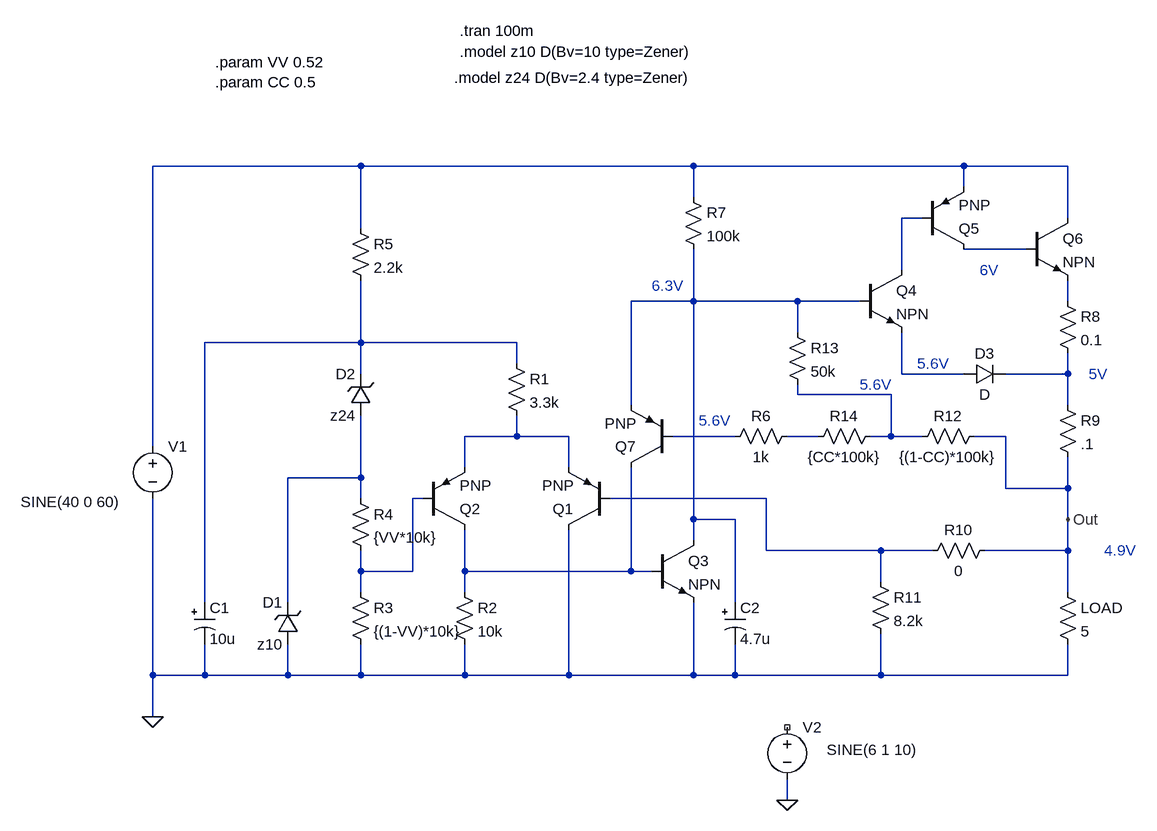
[diagram p0: schematic linear-power-supply.asc]
linear-power-supply.asc, the LTspice schematic file:
Version 4
SHEET 1 928 768
WIRE -272 -224 -592 -224
WIRE 240 -224 -272 -224
WIRE 656 -224 240 -224
WIRE 816 -224 656 -224
WIRE 656 -192 656 -224
WIRE 240 -176 240 -224
WIRE 592 -144 560 -144
WIRE 816 -144 816 -224
WIRE -272 -128 -272 -224
WIRE 752 -96 656 -96
WIRE 560 -64 560 -144
WIRE 240 -16 240 -96
WIRE 240 -16 144 -16
WIRE 400 -16 240 -16
WIRE 496 -16 400 -16
WIRE 816 -16 816 -48
WIRE 400 32 400 -16
WIRE -272 48 -272 -48
WIRE -272 48 -512 48
WIRE -32 48 -272 48
WIRE -32 80 -32 48
WIRE -272 96 -272 48
WIRE 560 96 560 32
WIRE 656 96 560 96
WIRE 816 96 816 64
WIRE 816 96 720 96
WIRE 400 128 400 112
WIRE 544 128 400 128
WIRE 144 144 144 -16
WIRE 816 144 816 96
WIRE -32 192 -32 160
WIRE -32 192 -112 192
WIRE 48 192 -32 192
WIRE 304 192 208 192
WIRE 432 192 384 192
WIRE 544 192 544 128
WIRE 544 192 512 192
WIRE 592 192 544 192
WIRE 720 192 672 192
WIRE -592 208 -592 -224
WIRE -112 240 -112 192
WIRE 48 240 48 192
WIRE -272 256 -272 160
WIRE -272 256 -384 256
WIRE 720 272 720 192
WIRE 816 272 816 224
WIRE 816 272 720 272
WIRE -272 288 -272 256
WIRE -176 288 -192 288
WIRE 352 288 112 288
WIRE 240 320 240 -16
WIRE 304 320 240 320
WIRE 816 320 816 272
WIRE 240 352 240 320
WIRE 352 368 352 288
WIRE 528 368 352 368
WIRE 608 368 528 368
WIRE 816 368 816 320
WIRE 816 368 688 368
WIRE -272 400 -272 368
WIRE -192 400 -192 288
WIRE -192 400 -272 400
WIRE -112 400 -112 336
WIRE 144 400 144 240
WIRE 144 400 -112 400
WIRE 176 400 144 400
WIRE 528 416 528 368
WIRE -272 432 -272 400
WIRE -112 432 -112 400
WIRE 816 432 816 368
WIRE -512 448 -512 48
WIRE -384 448 -384 256
WIRE 304 448 304 320
WIRE -592 560 -592 288
WIRE -512 560 -512 512
WIRE -512 560 -592 560
WIRE -384 560 -384 512
WIRE -384 560 -512 560
WIRE -272 560 -272 512
WIRE -272 560 -384 560
WIRE -112 560 -112 512
WIRE -112 560 -272 560
WIRE 48 560 48 336
WIRE 48 560 -112 560
WIRE 240 560 240 448
WIRE 240 560 48 560
WIRE 304 560 304 512
WIRE 304 560 240 560
WIRE 528 560 528 496
WIRE 528 560 304 560
WIRE 816 560 816 512
WIRE 816 560 528 560
WIRE -592 624 -592 560
WIRE 384 752 384 720
FLAG -592 624 0
FLAG 816 320 Out
FLAG 384 752 0
SYMBOL pnp 112 336 R180
SYMATTR InstName Q1
SYMBOL pnp -176 336 M180
SYMATTR InstName Q2
SYMBOL res -48 64 R0
SYMATTR InstName R1
SYMATTR Value 3.3k
SYMBOL res -128 416 R0
SYMATTR InstName R2
SYMATTR Value 10k
SYMBOL res -288 416 R0
SYMATTR InstName R3
SYMATTR Value {(1-VV)*10k}
SYMBOL res -288 272 R0
SYMATTR InstName R4
SYMATTR Value {VV*10k}
SYMBOL res -288 -144 R0
SYMATTR InstName R5
SYMATTR Value 2.2k
SYMBOL zener -368 512 R180
WINDOW 0 24 64 Left 2
WINDOW 3 24 0 Left 2
SYMATTR InstName D1
SYMATTR Value z10
SYMBOL zener -256 160 R180
WINDOW 0 24 64 Left 2
WINDOW 3 24 0 Left 2
SYMATTR InstName D2
SYMATTR Value z24
SYMBOL voltage -592 192 R0
WINDOW 3 -203 101 Left 2
SYMATTR Value SINE(40 0 60)
SYMATTR InstName V1
SYMBOL polcap -528 448 R0
SYMATTR InstName C1
SYMATTR Value 10u
SYMBOL npn 176 352 R0
SYMATTR InstName Q3
SYMBOL res 224 -192 R0
SYMATTR InstName R7
SYMATTR Value 100k
SYMBOL npn 496 -64 R0
SYMATTR InstName Q4
SYMBOL pnp 592 -96 M180
SYMATTR InstName Q5
SYMBOL npn 752 -144 R0
SYMATTR InstName Q6
SYMBOL diode 656 112 R270
WINDOW 0 32 32 VTop 2
WINDOW 3 0 32 VBottom 2
SYMATTR InstName D3
SYMBOL res 800 -32 R0
SYMATTR InstName R8
SYMATTR Value 0.1
SYMBOL res 800 128 R0
SYMATTR InstName R9
SYMATTR Value .1
SYMBOL res 800 416 R0
SYMATTR InstName LOAD
SYMATTR Value 5
SYMBOL res 704 352 R90
WINDOW 0 0 56 VBottom 2
WINDOW 3 32 56 VTop 2
SYMATTR InstName R10
SYMATTR Value 0
SYMBOL res 512 400 R0
SYMATTR InstName R11
SYMATTR Value 8.2k
SYMBOL polcap 288 448 R0
SYMATTR InstName C2
SYMATTR Value 4.7u
SYMBOL pnp 208 240 R180
SYMATTR InstName Q7
SYMBOL res 400 176 R90
WINDOW 0 0 56 VBottom 2
WINDOW 3 32 56 VTop 2
SYMATTR InstName R6
SYMATTR Value 1k
SYMBOL res 688 176 R90
WINDOW 0 0 56 VBottom 2
WINDOW 3 32 56 VTop 2
SYMATTR InstName R12
SYMATTR Value {(1-CC)*100k}
SYMBOL res 384 16 R0
SYMATTR InstName R13
SYMATTR Value 50k
SYMBOL res 528 176 R90
WINDOW 0 0 56 VBottom 2
WINDOW 3 32 56 VTop 2
SYMATTR InstName R14
SYMATTR Value {CC*100k}
SYMBOL voltage 384 624 R0
WINDOW 3 61 51 Left 2
SYMATTR Value SINE(6 1 10)
SYMATTR InstName V2
TEXT -128 -360 Left 2 !.model z24 D(Bv=2.4 type=Zener)
TEXT -120 -432 Left 2 !.tran 100m
TEXT -120 -400 Left 2 !.model z10 D(Bv=10 type=Zener)
TEXT 872 368 Left 2 ;4.9V
TEXT 584 80 Left 2 ;5.6V
TEXT 176 -40 Left 2 ;6.3V
TEXT 680 -64 Left 2 ;6V
TEXT -496 -384 Left 2 !.param VV 0.52\n.param CC 0.5
TEXT 248 168 Left 2 ;5.6V
TEXT 496 112 Left 2 ;5.6V
TEXT 848 96 Left 2 ;5V

The netlist it stands for:
* linear-power-supply.asc
Q1 0 N015 N010 0 PNP
Q2 N016 N014 N010 0 PNP
R1 N006 N010 3.3k
R2 N016 0 10k
R3 N014 0 {(1-VV)*10k}
R4 N013 N014 {VV*10k}
R5 N001 N006 2.2k
D1 0 N013 z10
D2 N013 N006 z24
V1 N001 0 SINE(40 0 60)
C1 N006 0 10u
Q3 N004 N016 0 0 NPN
R7 N001 N004 100k
Q4 N002 N004 N007 0 NPN
Q5 N003 N002 N001 0 PNP
Q6 N001 N003 N005 0 NPN
D3 N007 N008 D
R8 N005 N008 0.1
R9 N008 Out .1
R§LOAD Out 0 5
R10 Out N015 0
R11 N015 0 8.2k
C2 N004 0 4.7u
Q7 N016 N011 N004 0 PNP
R6 N012 N011 1k
R12 Out N009 {(1-CC)*100k}
R13 N004 N009 50k
R14 N009 N012 {CC*100k}
V2 NC_01 0 SINE(6 1 10)
.model D D
.lib standard.dio
.model NPN NPN
.model PNP PNP
.lib standard.bjt
.model z24 D(Bv=2.4 type=Zener)
.tran 100m
.model z10 D(Bv=10 type=Zener)
* 4.9V
* 5.6V
* 6.3V
* 6V
.param VV 0.52
.param CC 0.5
* 5.6V
* 5.6V
* 5V
.backanno
.end